# EAGLE design Esp8266-01_PACSSol (EAGLE 9.5.2)
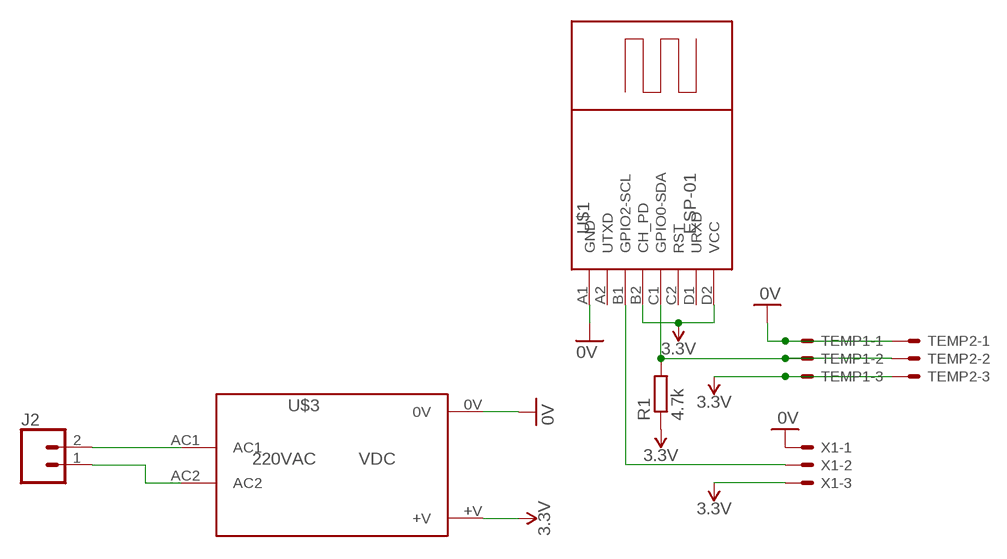
[diagram p0: schematic, sheet 1]

## Parts
J2  CONN_025MM  [BORNIER_A_VIS_2_5.12MM]
R1  4.7k  R-EU_0207/10  [0207/10]
TEMP1  JST-XH-03-PIN-LONG-PAD  [JST-XH-03-PACKAGE-LONG-PAD]
TEMP2  JST-XH-03-PIN-LONG-PAD  [JST-XH-03-PACKAGE-LONG-PAD]
U$1  ESP-01  [ESP-01]
U$3  TSP05-5V-3W  [TSP05-VDC-3W]
X1  JST-XH-03-PIN-LONG-PAD  [JST-XH-03-PACKAGE-LONG-PAD]

## Nets
0V: TEMP1.1 TEMP2.1 U$1.A1(GND) U$3.0V X1.1
3.3V: R1.1 TEMP1.3 TEMP2.3 U$1.B2(CH_PD) U$1.D2(VCC) U$3.+V X1.3
N$1: J2.2 U$3.AC1
N$2: J2.1 U$3.AC2
N$3: U$1.B1(GPIO2-SCL) X1.2
N$4: R1.2 TEMP1.2 TEMP2.2 U$1.C1(GPIO0-SDA)
Unconnected: U$1.A2(UTXD) U$1.C2(RST) U$1.D1(URXD)

## Library data of the parts
J2 = _Remy:CONN_02: Multi connection point. Often used as Generic Header-pin footprint for 0.1 inch spaced/style header connections On any of the 0.1 inch spaced packages, you can populate with these: Break Away Headers - Straight <https://www.sparkfun.com/products/116> (PRT-00116) Break Away Male Headers - Right Angle <https://www.sparkfun.com/products/553> (PRT-00553) Female Headers <https://www.sparkfun.com/products/115> (PRT-00115) Break Away Headers - Machine Pin <https://www.sparkfun.com/products/117> (PRT-00117) Break Away Female Headers - Swiss Machine Pin <https://www.sparkfun.com/products/743> (PRT-00743) For SCREWTERMINALS and SPRING TERMINALS visit here: Screw Terimnals on SparkFun.com <https://www.sparkfun.com/search/results?term=Screw+Terminals> (5mm/3.5mm/2.54mm spacing) This device is also useful as a general connection point to wire up your design to another part of your project. Our various solder wires solder well into these plated through hole pads. Hook-Up Wire - Assortment (Stranded, 22 AWG) <https://www.sparkfun.com/products/11375> (PRT-11375) Hook-Up Wire - Assortment (Solid Core, 22 AWG) <https://www.sparkfun.com/products/11367> (PRT-11367) View the entire wire category on our website here <https://www.sparkfun.com/categories/141> Special notes: Molex polarized connector foot print use with: PRT-08233 with associated crimp pins and housings. 2.54_SCREWTERM for use with PRT-10571. 3.5mm Screw Terminal footprints for PRT-08084 5mm Screw Terminal footprints for use with PRT-08432; SF_SKU: PRT-08432
R1 = 04_Remy:R-EU_: RESISTOR, European symbol
TEMP1 TEMP2 X1 = con-JST XH Connectors v1-0:JST-XH-03-PIN: JST XH Connector 2 Pin Wire to board connector. Pitch: 2,54 mm, (0.100") Number of pins: 3 Created by Rembrandt Electronics www.rembrandtelectronics.com
U$1 = _Remy:ESP-01: Wireless Wi-Fi ESP-01 Module based on ESP8266 chip Click here to find device on ebay.com <http://www.ebay.com/sch/esp8266+esp+01+transceiver>
U$3 = _Remy:TSP05-5V-3W

## Board
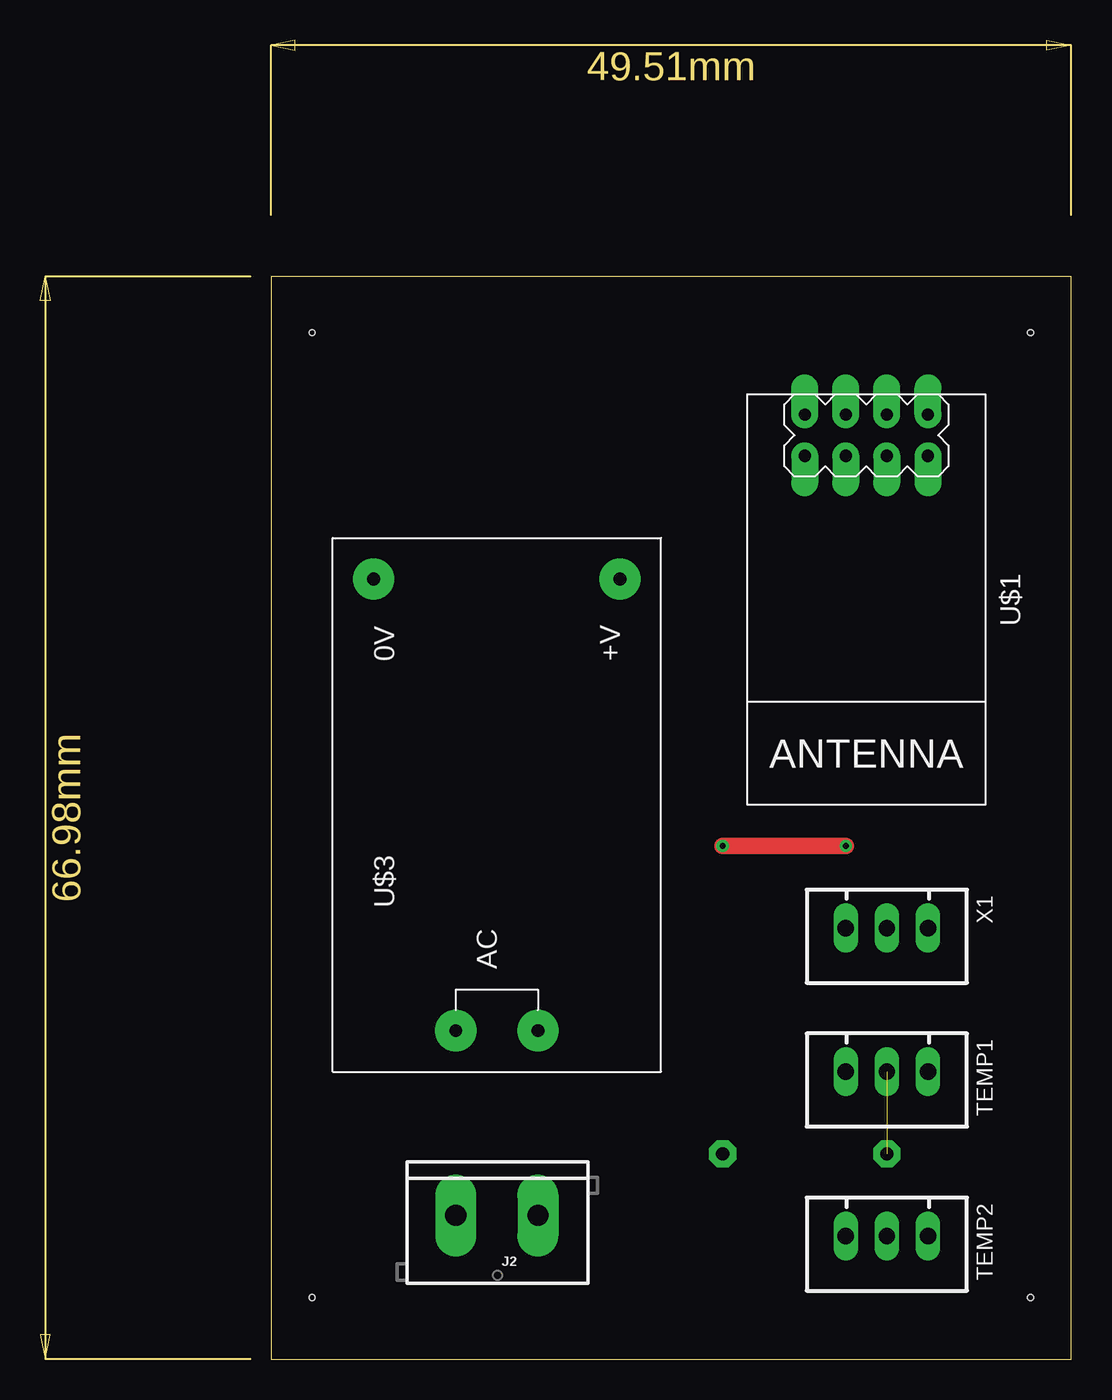
[diagram p1: board, top side]
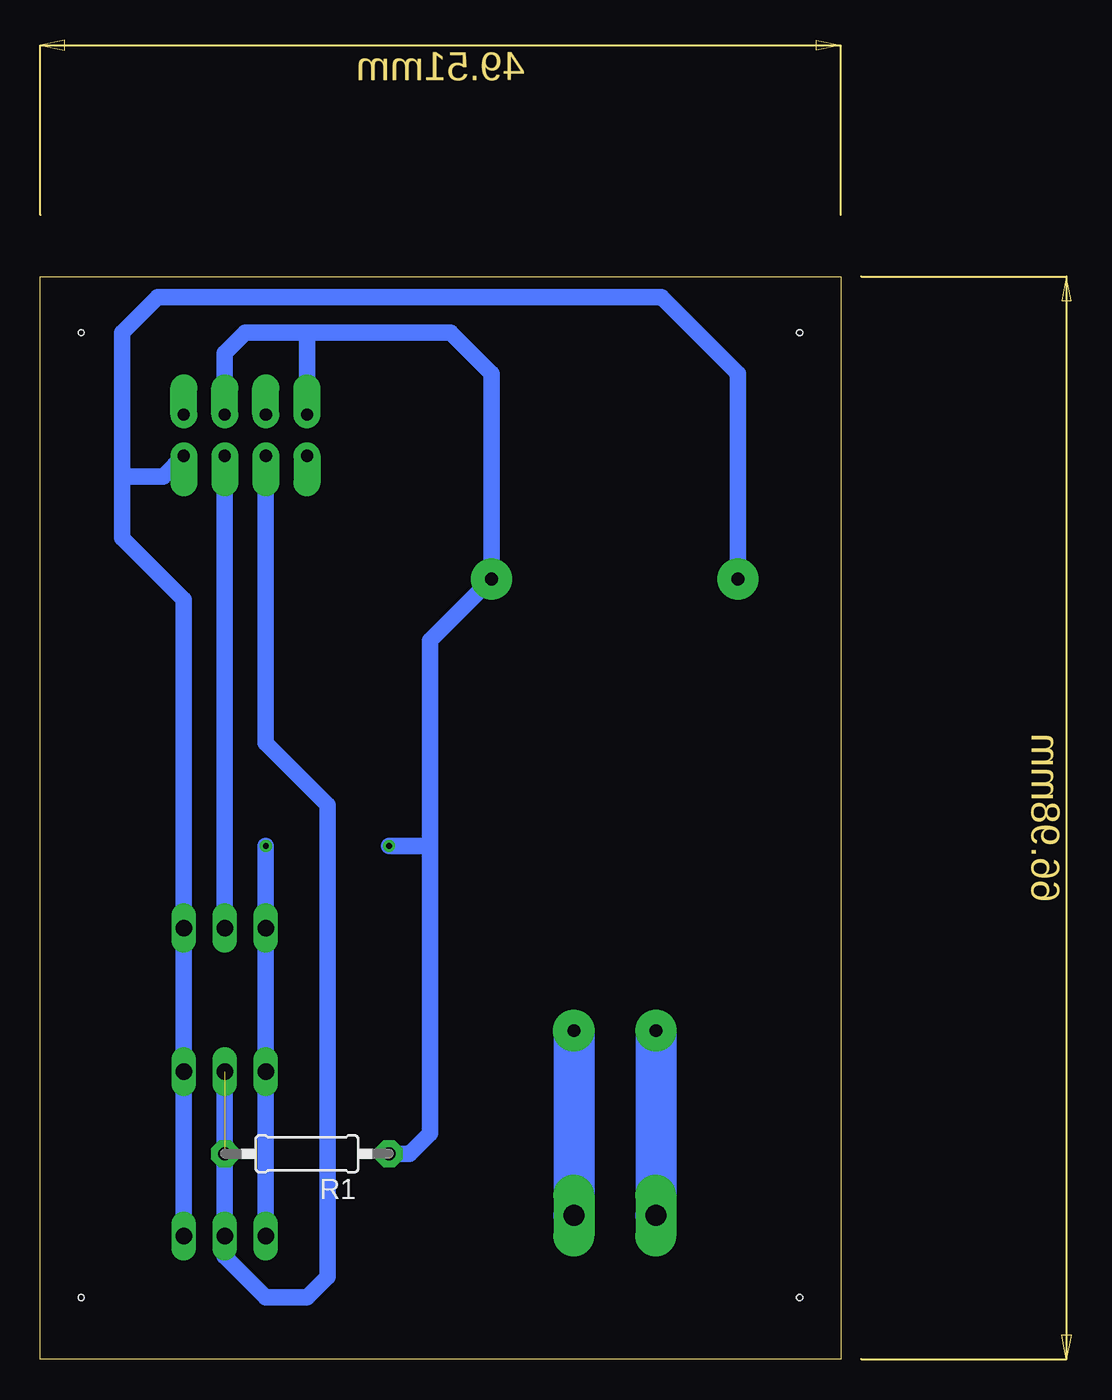
[diagram p2: board, bottom side, seen from below]

Size 49.51 x 66.98 mm. Coordinates in mm from the lower left corner, seen from the top.
Outline: 0,0 49.51,0 49.51,66.98 0,66.98 0,0
Copper layers (1*16): Top 0.035mm / dielectric 0.15mm / Bottom 0.035mm
Design rules "FastGcode-DesignRules": minimum track width 6mil, minimum drill 0.35mm, track to track 6mil, track to pad 6mil, pad to pad 6mil, via to via 6mil, smd to smd 6mil, copper to edge 31mil, drill to drill 6mil, minimum pad ring 5mil, minimum via ring 8mil, stop-mask expansion 4mil, vias tented up to drill 0mil, thermal gap 165mil
Holes 0.35 mm at 2.54,63.5 46.99,63.5 46.99,3.81 2.54,3.81

### Footprints (pad centres in the part's own frame; a part is rotated, then mirrored left to right if it is on the bottom)
BORNIER_A_VIS_2_5.12MM = drill 1.3 pad 2.54 long: 1 -2.54,0; 2 2.54,0
0207/10 = drill 0.813 pad 1.676 octagon: 1 -5.08,0; 2 5.08,0
JST-XH-03-PACKAGE-LONG-PAD = drill 1.016 long: 1 -2.54,0; 2 0,0; 3 2.54,0
ESP-01 = drill 0.75 pad 1.676 offset: A1 -8.89,3.81; A2 -11.43,3.81; B1 -8.89,1.27; B2 -11.43,1.27; C1 -8.89,-1.27; C2 -11.43,-1.27; D1 -8.89,-3.81; D2 -11.43,-3.81
TSP05-VDC-3W = drill 0.8 pad 2.54: 0V 13.97,7.62; +V 13.97,-7.62; AC1 -13.97,2.54; AC2 -13.97,-2.54

### Placement (x,y rotation side)
J2  13.97,8.89 180 top
R1  33.02,12.7 180 bottom
TEMP1  38.1,17.78 180 top
TEMP2  38.1,7.62 180 top
U$1  36.83,46.99 270 top
U$3  13.97,34.29 90 top
X1  38.1,26.67 180 top

### Tracks (layer width: path | path; a pad name or v marks a point on that pad's centre or on a via)
0V
  Bottom 1.016: TEMP2.1 TEMP1.1 X1.1 40.64,46.99 44.45,50.8 44.45,54.61 | U$3.0V 6.35,60.96 11.07,65.69 42.27,65.69 44.45,63.5 44.45,54.61 | U$1.A1 41.91,54.61 44.45,54.61
3.3V  (via drill 0.35)
  Top 1.016: v35.56,31.75 v27.94,31.75
  Bottom 1.016: 35.56,18.03 TEMP1.3 | TEMP1.3 TEMP2.3 | TEMP1.3 X1.3 v35.56,31.75 | U$1.B2 38.1,62.23 36.83,63.5 33.02,63.5 | 33.02,63.5 24.13,63.5 21.59,60.96 U$3.+V 25.4,44.45 25.4,31.75 | U$1.D2 33.02,63.5 | 25.4,31.75 25.4,13.97 26.67,12.7 R1.1 | v27.94,31.75 25.4,31.75
N$1
  Bottom 2.54: U$3.AC1 J2.2
N$2
  Bottom 2.54: U$3.AC2 J2.1
N$3
  Bottom 1.016: U$1.B1 X1.2
N$4  (1 unrouted)
  Bottom 1.016: TEMP1.2 TEMP2.2 38.1,6.35 35.56,3.81 33.02,3.81 31.75,5.08 31.75,34.29 35.56,38.1 U$1.C1